# Altium project NBP9 Altera Cyclone BGA456 Rev1.00.PrjPcb
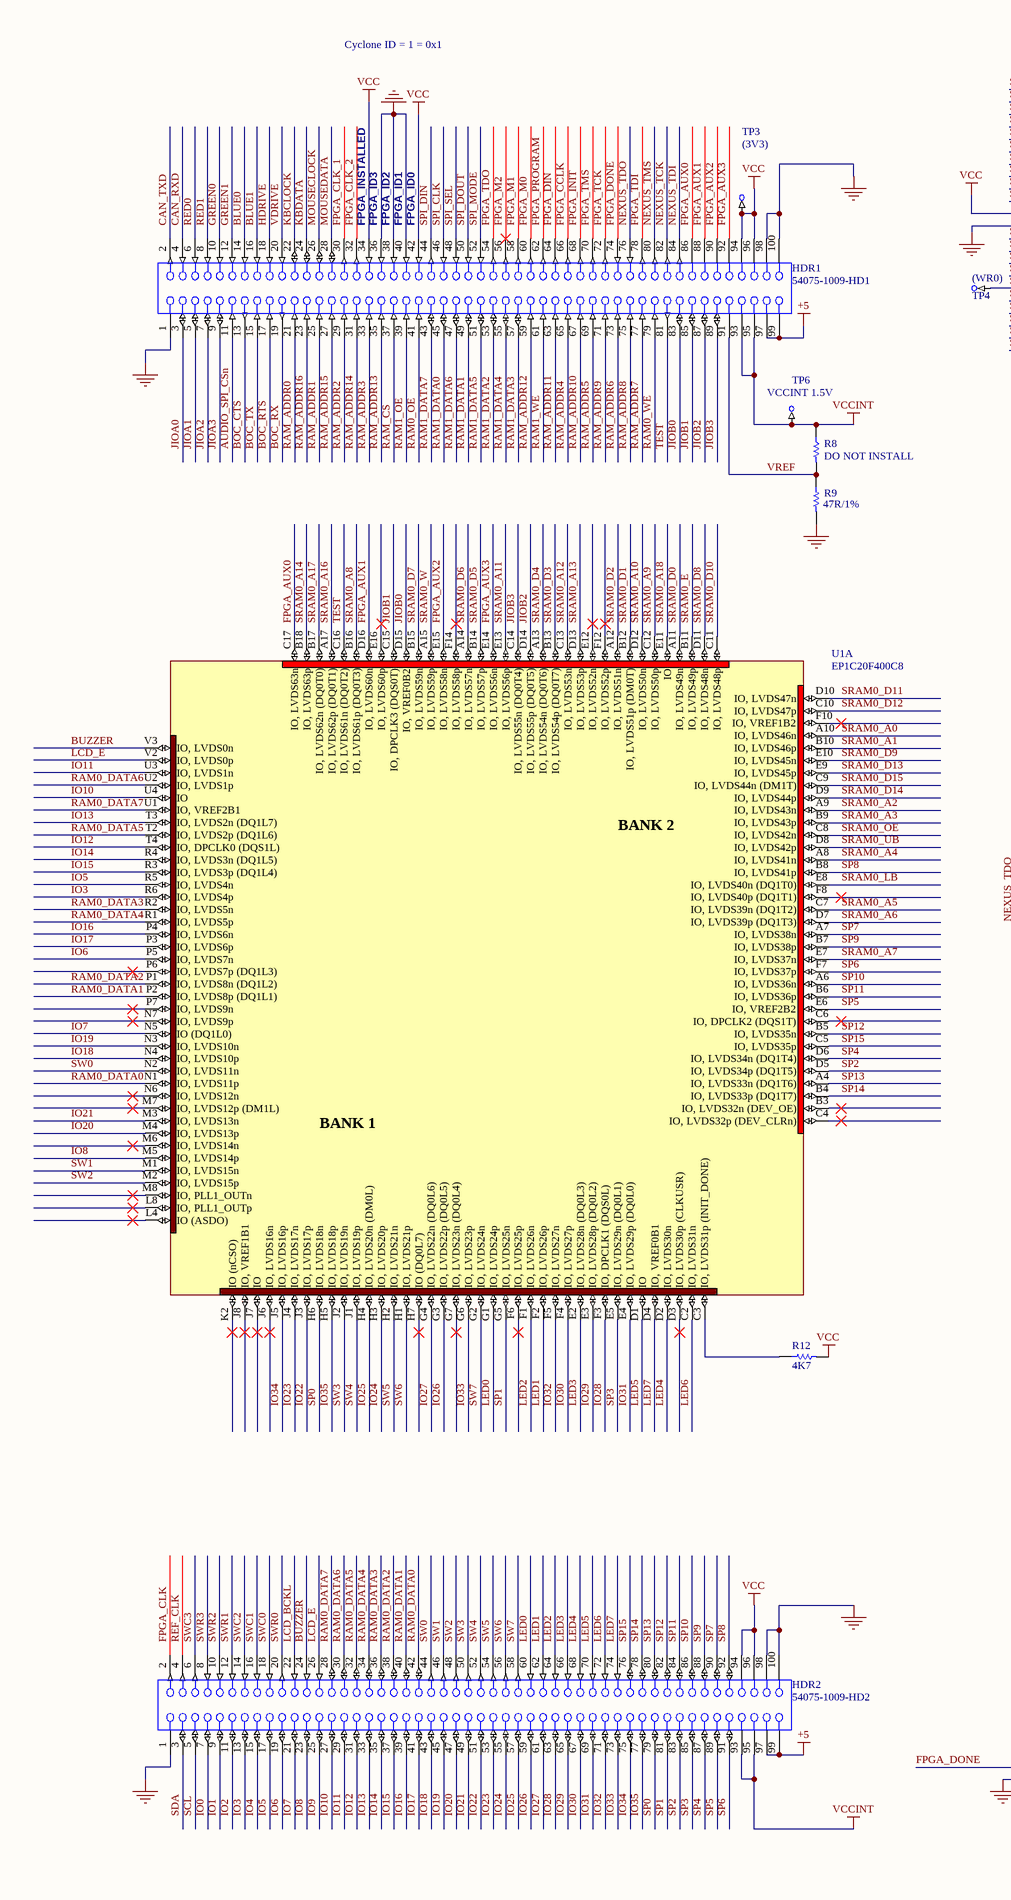
[diagram p0: NBP9 Altera Cyclone BGA456 Rev1.00.SchDoc, left]
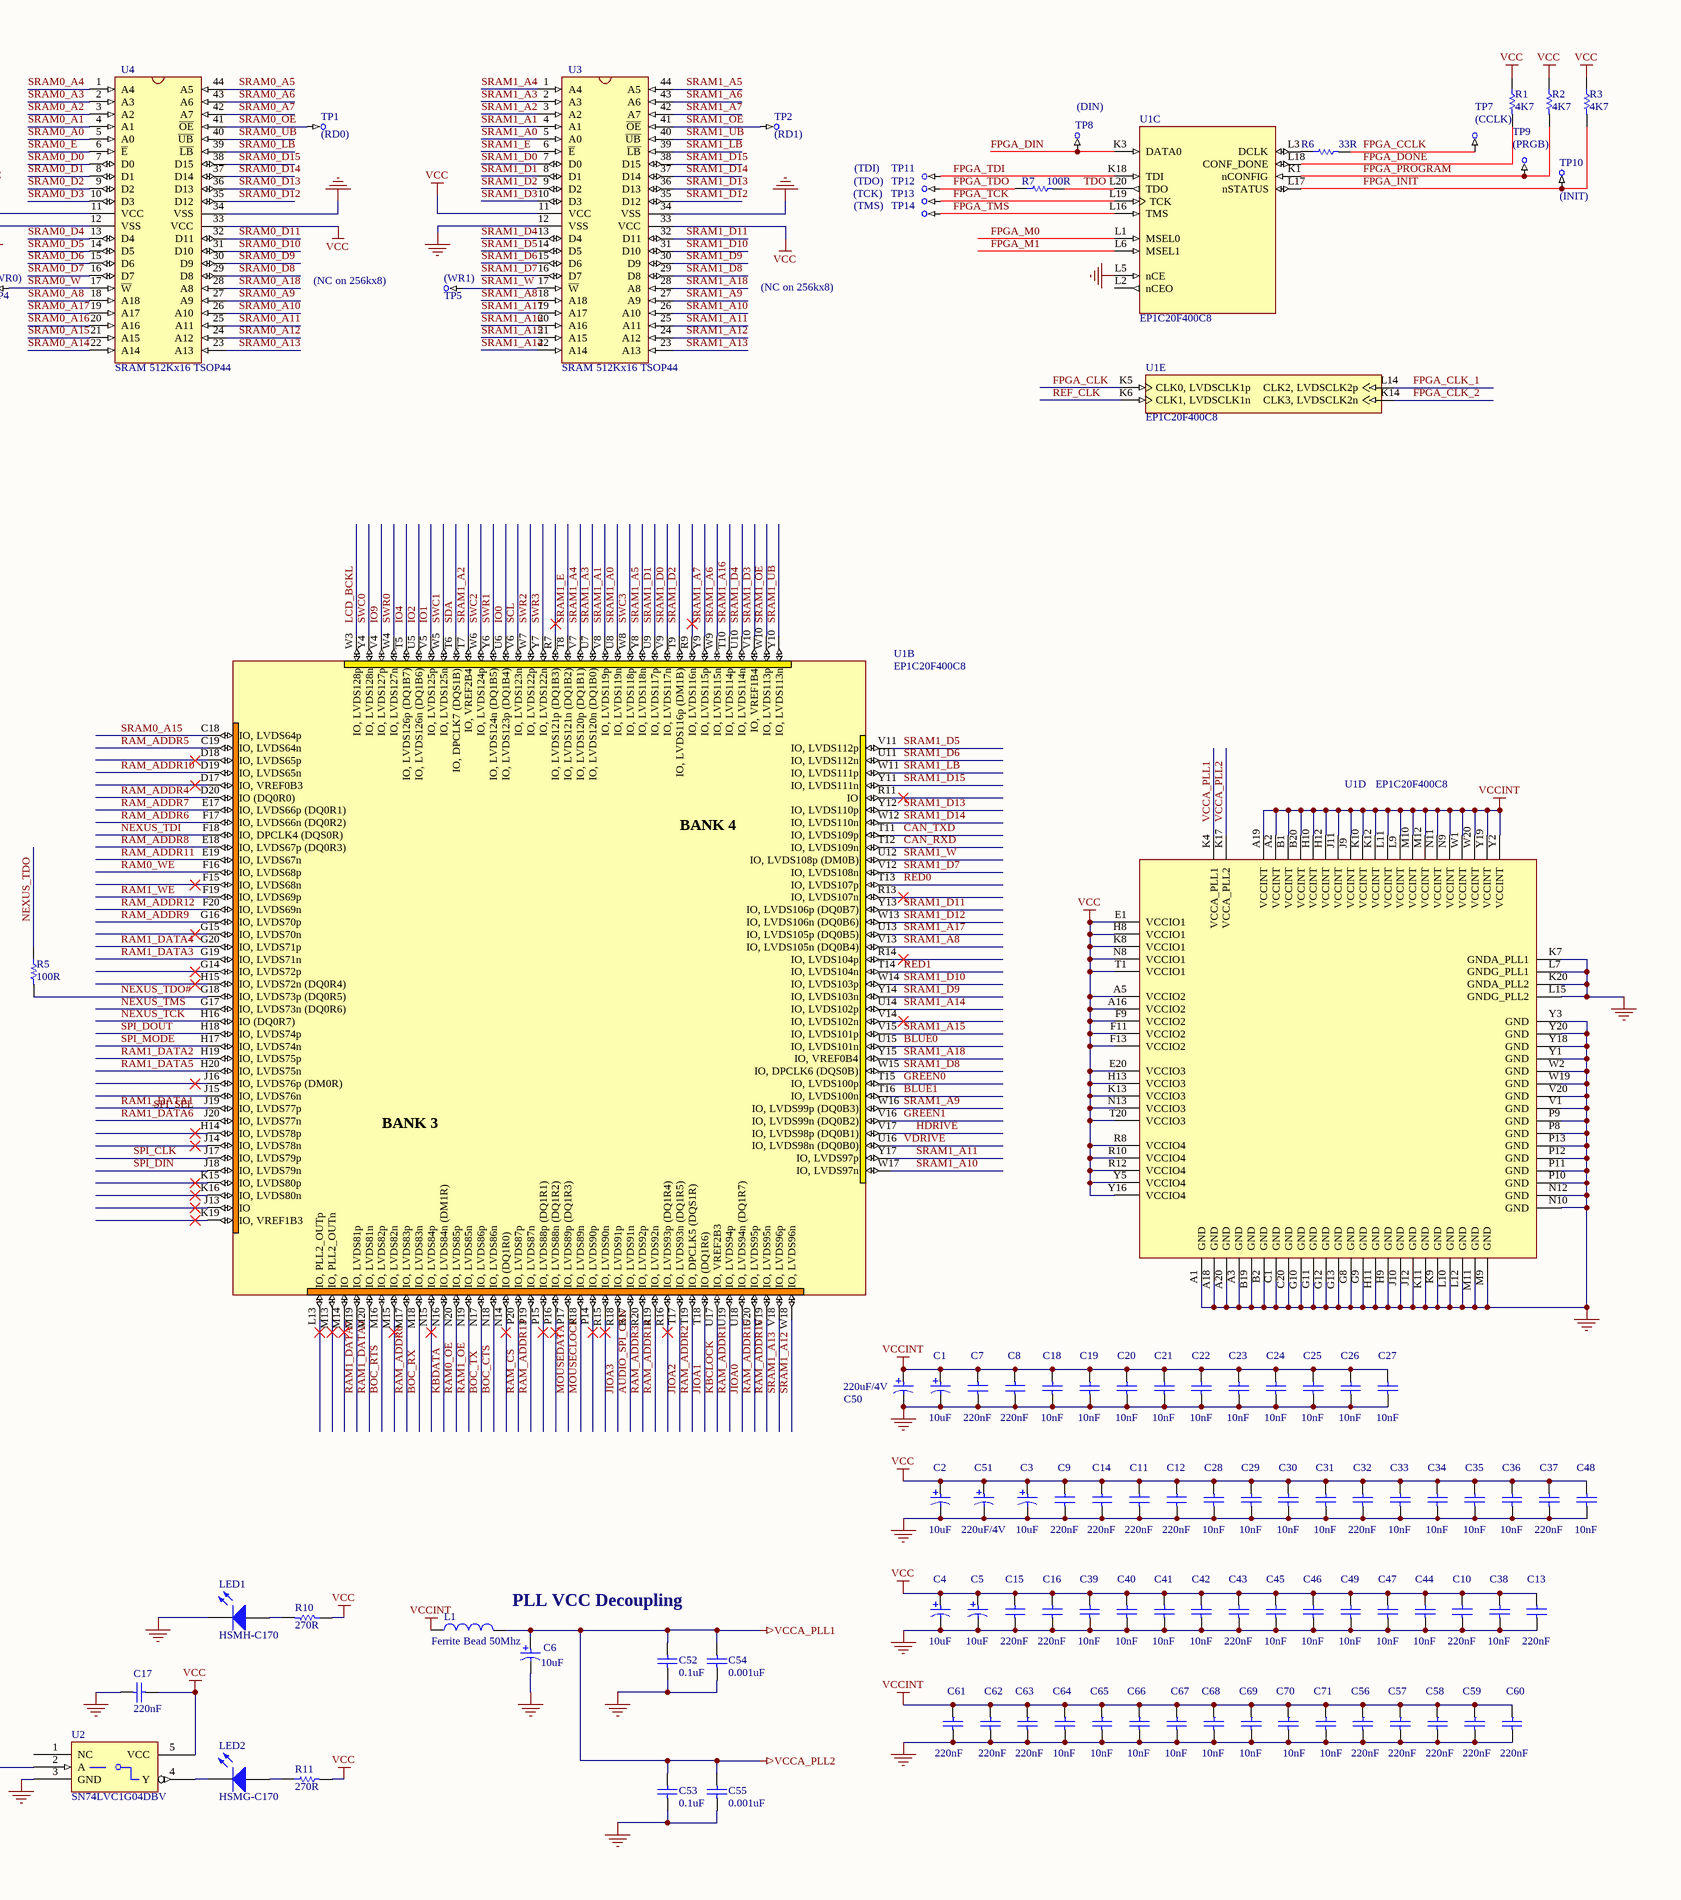
[diagram p1: NBP9 Altera Cyclone BGA456 Rev1.00.SchDoc, right]
1 sheet, 105 parts. Net scope: global (net labels, ports and power ports of the same name join across sheets).
Board file: NBP9 Altera Cyclone BGA456 Rev1.00.PcbDoc

## Sheet NBP9 Altera Cyclone BGA456 Rev1.00.SchDoc: Cyclone BGA400 Daughterboard
size A2; Author: Ch.W.; Organization: Altium Limited; Address1: L3, 12a Rodborough Rd; Address2: Frenchs Forest; Address3: NSW; Address4: Australia 2086; DocumentNumber: 1; Revision: 1.00; SheetNumber: 1; SheetTotal: 1; DocumentName: Cyclone BGA400 Daughterboard

### Parts
C1  10uF  [MCCT-B]
C2  10uF  [MCCT-B]
C3  10uF  [MCCT-B]
C4  10uF  [MCCT-B]
C5  10uF  [MCCT-B]
C6  10uF  [MCCT-B]
C7  220nF  [CC1005-0402]
C8  220nF  [CC1005-0402]
C9  220nF  [CC1608-0603]
C10  220nF  [CC1005-0402]
C11  220nF  [CC1608-0603]
C12  220nF  [CC1608-0603]
C13  220nF  [CC1005-0402]
C14  220nF  [CC1608-0603]
C15  220nF  [CC1608-0603]
C16  220nF  [CC1608-0603]
C17  220nF  [CC1608-0603]
C18  10nF  [CC1005-0402]
C19  10nF  [CC1005-0402]
C20  10nF  [CC1005-0402]
C21  10nF  [CC1005-0402]
C22  10nF  [CC1005-0402]
C23  10nF  [CC1005-0402]
C24  10nF  [CC1005-0402]
C25  10nF  [CC1005-0402]
C26  10nF  [CC1005-0402]
C27  10nF  [CC1005-0402]
C28  10nF  [CC1608-0603]
C29  10nF  [CC1608-0603]
C30  10nF  [CC1005-0402]
C31  10nF  [CC1005-0402]
C32  220nF  [CC1608-0603]
C33  10nF  [CC1608-0603]
C34  10nF  [CC1608-0603]
C35  10nF  [CC1608-0603]
C36  10nF  [CC1005-0402]
C37  220nF  [CC1608-0603]
C38  10nF  [CC1005-0402]
C39  10nF  [CC1608-0603]
C40  10nF  [CC1608-0603]
C41  10nF  [CC1608-0603]
C42  10nF  [CC1608-0603]
C43  220nF  [CC1608-0603]
C44  10nF  [CC1005-0402]
C45  10nF  [CC1608-0603]
C46  10nF  [CC1608-0603]
C47  10nF  [CC1005-0402]
C48  10nF  [CC1608-0603]
C49  10nF  [CC1005-0402]
C50  220uF/4V  [MCCT-D]
C51  220uF/4V  [MCCT-D]
C52  0.1uF  [CC1608-0603]
C53  0.1uF  [CC1608-0603]
C54  0.001uF  [CC1005-0402]
C55  0.001uF  [CC1005-0402]
C56  220nF  [CC1608-0603]
C57  220nF  [CC1608-0603]
C58  220nF  [CC1608-0603]
C59  220nF  [CC1608-0603]
C60  220nF  [CC1608-0603]
C61  220nF  [CC1608-0603]
C62  220nF  [CC1608-0603]
C63  220nF  [CC1608-0603]
C64  10nF  [CC1608-0603]
C65  10nF  [CC1608-0603]
C66  10nF  [CC1608-0603]
C67  10nF  [CC1608-0603]
C68  10nF  [CC1608-0603]
C69  10nF  [CC1608-0603]
C70  10nF  [CC1608-0603]
C71  10nF  [CC1608-0603]
HDR1  54075-1009-HD1  [54075]
HDR2  54075-1009-HD2  [54075]
L1  Ferrite Bead 50Mhz  [CC1608-0603]
LED1  HSMH-C170  [SMD _LED]
LED2  HSMG-C170  [SMD _LED]
R1  4K7  [CC2012-0805]
R2  4K7  [CC2012-0805]
R3  4K7  [CC2012-0805]
R5  100R  [CR2012-0805]
R6  33R  [CC2012-0805]
R7  100R  [CC2012-0805]
R8  DO NOT INSTALL  [CR2012-0805]
R9  47R/1%  [CR2012-0805]
R10  270R  [CR2012-0805]
R11  270R  [CR2012-0805]
R12  4K7  [CC2012-0805]
TP1  (RD0)  [TestPin]  (no BOM)
TP2  (RD1)  [TestPin]  (no BOM)
TP3  (3V3)  [TestPin]  (no BOM)
TP4  (WR0)  [TestPin]  (no BOM)
TP5  (WR1)  [TestPin]  (no BOM)
TP6  VCCINT 1.5V  [TestPin]  (no BOM)
TP7  (CCLK)  [TestPin]  (no BOM)
TP8  (DIN)  [TestPin]  (no BOM)
TP9  (PRGB)  [TestPin]  (no BOM)
TP10  (INIT)  [TestPin]  (no BOM)
TP11  (TDI)  [TestPin]  (no BOM)
TP12  (TDO)  [TestPin]  (no BOM)
TP13  (TCK)  [TestPin]  (no BOM)
TP14  (TMS)  [TestPin]  (no BOM)
U1  EP1C20F400C8  [FBGA400]  (parts A,B,C,D,E of 5)
U2  SN74LVC1G04DBV  [SO-G5/P.95]
U3  SRAM 512Kx16 TSOP44  [SO-G44/P.8]
U4  SRAM 512Kx16 TSOP44  [SO-G44/P.8]

### Nets
+5: HDR1.97 HDR1.99 HDR2.97 HDR2.99
GND: C1.2 C2.2 C3.2 C4.2 C5.2 C6.2 C7.2 C8.2 C9.2 C10.2 C11.2 C12.2 C13.2 C14.2 C15.2 C16.2 C17.1 C18.2 C19.2 C20.2 C21.2 C22.2 C23.2 C24.2 C25.2 C26.2 C27.2 C28.2 C29.2 C30.2 C31.2 C32.2 C33.2 C34.2 C35.2 C36.2 C37.2 C38.2 C39.2 C40.2 C41.2 C42.2 C43.2 C44.2 C45.2 C46.2 C47.2 C48.2 C49.2 C50.2 C51.2 C52.2 C53.2 C54.2 C55.2 C56.2 C57.2 C58.2 C59.2 C60.2 C61.2 C62.2 C63.2 C64.2 C65.2 C66.2 C67.2 C68.2 C69.2 C70.2 C71.2 HDR1.1 HDR1.36 HDR1.38 HDR1.40 HDR1.98 HDR1.100 HDR2.1 HDR2.98 HDR2.100 LED1.2(K) R9.2 U1.A1(GND) U1.A3(GND) U1.A18(GND) U1.A20(GND) U1.B2(GND) U1.B19(GND) U1.C1(GND) U1.C20(GND) U1.G8(GND) U1.G9(GND) U1.G10(GND) U1.G11(GND) U1.G12(GND) U1.G13(GND) U1.H9(GND) U1.H11(GND) U1.J10(GND) U1.J12(GND) U1.K7(GNDA_PLL1) U1.K9(GND) U1.K11(GND) U1.K20(GNDA_PLL2) U1.L5(nCE) U1.L7(GNDG_PLL1) U1.L10(GND) U1.L12(GND) U1.L15(GNDG_PLL2) U1.M9(GND) U1.M11(GND) U1.N10(GND) U1.N12(GND) U1.P8(GND) U1.P9(GND) U1.P10(GND) U1.P11(GND) U1.P12(GND) U1.P13(GND) U1.V1(GND) U1.V20(GND) U1.W2(GND) U1.W19(GND) U1.Y1(GND) U1.Y3(GND) U1.Y18(GND) U1.Y20(GND) U2.3(GND) U3.12(VSS) U3.34(VSS) U4.12(VSS) U4.34(VSS)
VCC: C2.1 C3.1 C4.1 C5.1 C9.1 C10.1 C11.1 C12.1 C13.1 C14.1 C15.1 C16.1 C17.2 C28.1 C29.1 C30.1 C31.1 C32.1 C33.1 C34.1 C35.1 C36.1 C37.1 C38.1 C39.1 C40.1 C41.1 C42.1 C43.1 C44.1 C45.1 C46.1 C47.1 C48.1 C49.1 C51.1 HDR1.34 HDR1.42 HDR1.94 HDR1.96 HDR2.94 HDR2.96 R1.1 R2.1 R3.1 R10.1 R11.2 R12.2 TP3.1 U1.A5(VCCIO2) U1.A16(VCCIO2) U1.E1(VCCIO1) U1.E20(VCCIO3) U1.F9(VCCIO2) U1.F11(VCCIO2) U1.F13(VCCIO2) U1.H8(VCCIO1) U1.H13(VCCIO3) U1.K8(VCCIO1) U1.K13(VCCIO3) U1.N8(VCCIO1) U1.N13(VCCIO3) U1.R8(VCCIO4) U1.R10(VCCIO4) U1.R12(VCCIO4) U1.T1(VCCIO1) U1.T20(VCCIO3) U1.Y5(VCCIO4) U1.Y16(VCCIO4) U2.5(VCC) U3.11(VCC) U3.33(VCC) U4.11(VCC) U4.33(VCC)
VCCA_PLL1: C6.1 C52.1 C53.1 C54.1 C55.1 L1.2 U1.K4(VCCA_PLL1) U1.K17(VCCA_PLL2)  [also labelled VCCA_PLL2]
VCCINT: C1.1 C7.1 C8.1 C18.1 C19.1 C20.1 C21.1 C22.1 C23.1 C24.1 C25.1 C26.1 C27.1 C50.1 C56.1 C57.1 C58.1 C59.1 C60.1 C61.1 C62.1 C63.1 C64.1 C65.1 C66.1 C67.1 C68.1 C69.1 C70.1 C71.1 HDR1.93 HDR1.95 HDR2.93 HDR2.95 L1.1 R8.1 TP6.1 U1.A2(VCCINT) U1.A19(VCCINT) U1.B1(VCCINT) U1.B20(VCCINT) U1.H10(VCCINT) U1.H12(VCCINT) U1.J9(VCCINT) U1.J11(VCCINT) U1.K10(VCCINT) U1.K12(VCCINT) U1.L9(VCCINT) U1.L11(VCCINT) U1.M10(VCCINT) U1.M12(VCCINT) U1.N9(VCCINT) U1.N11(VCCINT) U1.W1(VCCINT) U1.W20(VCCINT) U1.Y2(VCCINT) U1.Y19(VCCINT)
AUDIO_SPI_CSn: HDR1.11 U1.R17(IO,_LVDS91n)
BLUE0: HDR1.14 U1.U15(IO,_LVDS101n)
BLUE1: HDR1.16 U1.T16(IO,_LVDS100n)
BOC_CTS: HDR1.13 U1.N18(IO,_LVDS86n)
BOC_RTS: HDR1.17 U1.M16(IO,_LVDS82p)
BOC_RX: HDR1.19 U1.M18(IO,_LVDS83n)
BOC_TX: HDR1.15 U1.N17(IO,_LVDS86p)
BUZZER: HDR2.24 U1.V3(IO,_LVDS0n)
CAN_RXD: HDR1.4 U1.T12(IO,_LVDS109n)
CAN_TXD: HDR1.2 U1.T11(IO,_LVDS109p)
FPGA_AUX0: HDR1.86 U1.C17(IO,_LVDS63n)
FPGA_AUX1: HDR1.88 U1.D16(IO,_LVDS60n)
FPGA_AUX2: HDR1.90 U1.E15(IO,_LVDS58n)
FPGA_AUX3: HDR1.92 U1.E14(IO,_LVDS56n)
FPGA_CCLK: HDR1.66 R6.2 TP7.1
FPGA_CLK: HDR2.2 U1.K5(CLK0,_LVDSCLK1p)
FPGA_CLK_1: HDR1.30 U1.L14(CLK2,_LVDSCLK2p)
FPGA_CLK_2: HDR1.32 U1.K14(CLK3,_LVDSCLK2n)
FPGA_DIN: HDR1.64 TP8.1 U1.K3(DATA0)
FPGA_DONE: HDR1.74 R1.2 U1.L18(CONF_DONE) U2.2(A)
FPGA_INIT: HDR1.68 R3.2 TP10.1 U1.L17(nSTATUS)
FPGA_M0: HDR1.60 U1.L1(MSEL0)
FPGA_M1: HDR1.58 U1.L6(MSEL1)
FPGA_M2: HDR1.56
FPGA_PROGRAM: HDR1.62 R2.2 TP9.1 U1.K1(nCONFIG)
FPGA_TCK: HDR1.72 TP13.1 U1.L19(TCK)
FPGA_TDI: HDR1.78 TP11.1 U1.K18(TDI)
FPGA_TDO: HDR1.54 R7.1 TP12.1
FPGA_TMS: HDR1.70 TP14.1 U1.L16(TMS)
GREEN0: HDR1.10 U1.T15(IO,_LVDS100p)
GREEN1: HDR1.12 U1.V16(IO,_LVDS99n_(DQ0B2))
HDRIVE: HDR1.18 U1.V17(IO,_LVDS98p_(DQ0B1))
IO0: HDR2.7 U1.U6(IO,_LVDS123p_(DQ1B4))
IO1: HDR2.9 U1.V5(IO,_LVDS125p)
IO2: HDR2.11 U1.U5(IO,_LVDS126n_(DQ1B6))
IO3: HDR2.13 U1.R6(IO,_LVDS4p)
IO4: HDR2.15 U1.T5(IO,_LVDS126p_(DQ1B7))
IO5: HDR2.17 U1.R5(IO,_LVDS4n)
IO6: HDR2.19 U1.P5(IO,_LVDS7n)
IO7: HDR2.21 U1.N5(IO_(DQ1L0))
IO8: HDR2.23 U1.M5(IO,_LVDS14p)
IO9: HDR2.25 U1.V4(IO,_LVDS127p)
IO10: HDR2.27 U1.U4(IO)
IO11: HDR2.29 U1.U3(IO,_LVDS1n)
IO12: HDR2.31 U1.T4(IO,_DPCLK0_(DQS1L))
IO13: HDR2.33 U1.T3(IO,_LVDS2n_(DQ1L7))
IO14: HDR2.35 U1.R4(IO,_LVDS3n_(DQ1L5))
IO15: HDR2.37 U1.R3(IO,_LVDS3p_(DQ1L4))
IO16: HDR2.39 U1.P4(IO,_LVDS6n)
IO17: HDR2.41 U1.P3(IO,_LVDS6p)
IO18: HDR2.43 U1.N4(IO,_LVDS10p)
IO19: HDR2.45 U1.N3(IO,_LVDS10n)
IO20: HDR2.47 U1.M4(IO,_LVDS13p)
IO21: HDR2.49 U1.M3(IO,_LVDS13n)
IO22: HDR2.51 U1.J3(IO,_LVDS17p)
IO23: HDR2.53 U1.J4(IO,_LVDS17n)
IO24: HDR2.55 U1.H3(IO,_LVDS20p)
IO25: HDR2.57 U1.H4(IO,_LVDS20n_(DM0L))
IO26: HDR2.59 U1.G3(IO,_LVDS22p_(DQ0L5))
IO27: HDR2.61 U1.G4(IO,_LVDS22n_(DQ0L6))
IO28: HDR2.63 U1.F3(IO,_DPCLK1_(DQS0L))
IO29: HDR2.65 U1.E3(IO,_LVDS28p_(DQ0L2))
IO30: HDR2.67 U1.F4(IO,_LVDS27p)
IO31: HDR2.69 U1.E4(IO,_LVDS29p_(DQ0L0))
IO32: HDR2.71 U1.F5(IO,_LVDS27n)
IO33: HDR2.73 U1.G6(IO,_LVDS23p)
IO34: HDR2.75 U1.J5(IO,_LVDS16p)
IO35: HDR2.77 U1.H5(IO,_LVDS18p)
JIOA0: HDR1.3 U1.U18(IO,_LVDS94n_(DQ1R7))
JIOA1: HDR1.5 U1.T18(IO_(DQ1R6))
JIOA2: HDR1.7 U1.T17(IO,_LVDS93n_(DQ1R5))
JIOA3: HDR1.9 U1.R18(IO,_LVDS91p)
JIOB0: HDR1.83 U1.D15(IO,_VREF0B2)
JIOB1: HDR1.85 U1.C15(IO,_DPCLK3_(DQS0T))
JIOB2: HDR1.87 U1.D14(IO,_LVDS55p_(DQ0T5))
JIOB3: HDR1.89 U1.C14(IO,_LVDS55n_(DQ0T4))
KBCLOCK: HDR1.22 U1.U17(IO,_VREF2B3)
KBDATA: HDR1.24 U1.N16(IO,_LVDS84n_(DM1R))
LCD_BCKL: HDR2.22 U1.W3(IO,_LVDS128p)
LCD_E: HDR2.26 U1.V2(IO,_LVDS0p)
LED0: HDR2.60 U1.G1(IO,_LVDS24p)
LED1: HDR2.62 U1.F2(IO,_LVDS26p)
LED2: HDR2.64 U1.F1(IO,_LVDS26n)
LED3: HDR2.66 U1.E2(IO,_LVDS28n_(DQ0L3))
LED4: HDR2.68 U1.D2(IO,_LVDS30n)
LED5: HDR2.70 U1.D1(IO)
LED6: HDR2.72 U1.C2(IO,_LVDS31n)
LED7: HDR2.74 U1.D4(IO,_VREF0B1)
MOUSECLOCK: HDR1.26 U1.P18(IO,_LVDS89n)
MOUSEDATA: HDR1.28 U1.P17(IO,_LVDS89p_(DQ1R3))
NEXUS_TCK: HDR1.82 U1.H16(IO_(DQ0R7))
NEXUS_TDI: HDR1.84 U1.F18(IO,_DPCLK4_(DQS0R))
NEXUS_TDO: HDR1.76 R5.1
NEXUS_TDO#: R5.2 U1.G18(IO,_LVDS73p_(DQ0R5))
NEXUS_TMS: HDR1.80 U1.G17(IO,_LVDS73n_(DQ0R6))
RAM0_DATA0: HDR2.42 U1.N1(IO,_LVDS11p)
RAM0_DATA1: HDR2.40 U1.P2(IO,_LVDS8p_(DQ1L1))
RAM0_DATA2: HDR2.38 U1.P1(IO,_LVDS8n_(DQ1L2))
RAM0_DATA3: HDR2.36 U1.R2(IO,_LVDS5n)
RAM0_DATA4: HDR2.34 U1.R1(IO,_LVDS5p)
RAM0_DATA5: HDR2.32 U1.T2(IO,_LVDS2p_(DQ1L6))
RAM0_DATA6: HDR2.30 U1.U2(IO,_LVDS1p)
RAM0_DATA7: HDR2.28 U1.U1(IO,_VREF2B1)
RAM0_OE: HDR1.41 U1.N20(IO,_LVDS85p)
RAM0_WE: HDR1.79 U1.F16(IO,_LVDS68p)
RAM1_DATA0: HDR1.45 U1.M20(IO,_LVDS81n)
RAM1_DATA1: HDR1.49 U1.J19(IO,_LVDS77p)
RAM1_DATA2: HDR1.53 U1.H19(IO,_LVDS75p)
RAM1_DATA3: HDR1.57 U1.G19(IO,_LVDS71n)
RAM1_DATA4: HDR1.55 U1.G20(IO,_LVDS71p)
RAM1_DATA5: HDR1.51 U1.H20(IO,_LVDS75n)
RAM1_DATA6: HDR1.47 U1.J20(IO,_LVDS77n)
RAM1_DATA7: HDR1.43 U1.M19(IO,_LVDS81p)
RAM1_OE: HDR1.39 U1.N19(IO,_LVDS85n)
RAM1_WE: HDR1.61 U1.F19(IO,_LVDS69p)
RAM_ADDR0: HDR1.21 U1.M17(IO,_LVDS83p)
RAM_ADDR1: HDR1.25 U1.U19(IO,_LVDS94p)
RAM_ADDR2: HDR1.29 U1.T19(IO,_DPCLK5_(DQS1R))
RAM_ADDR3: HDR1.33 U1.R20(IO,_LVDS92p)
RAM_ADDR4: HDR1.65 U1.D20(IO_(DQ0R0))
RAM_ADDR5: HDR1.69 U1.C19(IO,_LVDS64n)
RAM_ADDR6: HDR1.73 U1.F17(IO,_LVDS66n_(DQ0R2))
RAM_ADDR7: HDR1.77 U1.E17(IO,_LVDS66p_(DQ0R1))
RAM_ADDR8: HDR1.75 U1.E18(IO,_LVDS67p_(DQ0R3))
RAM_ADDR9: HDR1.71 U1.G16(IO,_LVDS70p)
RAM_ADDR10: HDR1.67 U1.D19(IO,_LVDS65n)
RAM_ADDR11: HDR1.63 U1.E19(IO,_LVDS67n)
RAM_ADDR12: HDR1.59 U1.F20(IO,_LVDS69n)
RAM_ADDR13: HDR1.35 U1.P19(IO,_LVDS87n)
RAM_ADDR14: HDR1.31 U1.R19(IO,_LVDS92n)
RAM_ADDR15: HDR1.27 U1.U20(IO,_LVDS95p)
RAM_ADDR16: HDR1.23 U1.V19(IO,_LVDS95n)
RAM_CS: HDR1.37 U1.P20(IO,_LVDS87p)
RED0: HDR1.6 U1.T13(IO,_LVDS107p)
RED1: HDR1.8 U1.T14(IO,_LVDS104n)
REF_CLK: HDR2.4 U1.K6(CLK1,_LVDSCLK1n)
SCL: HDR2.5 U1.V6(IO,_LVDS123n)
SDA: HDR2.3 U1.T6(IO,_DPCLK7_(DQS1B))
SP0: HDR2.79 U1.H6(IO,_LVDS18n)
SP1: HDR2.81 U1.G5(IO,_LVDS25n)
SP2: HDR2.83 U1.D5(IO,_LVDS34p_(DQ1T5))
SP3: HDR2.85 U1.E5(IO,_LVDS29n_(DQ0L1))
SP4: HDR2.87 U1.D6(IO,_LVDS34n_(DQ1T4))
SP5: HDR2.89 U1.E6(IO,_VREF2B2)
SP6: HDR2.91 U1.F7(IO,_LVDS37p)
SP7: HDR2.90 U1.A7(IO,_LVDS38n)
SP8: HDR2.92 U1.B8(IO,_LVDS41p)
SP9: HDR2.88 U1.B7(IO,_LVDS38p)
SP10: HDR2.86 U1.A6(IO,_LVDS36n)
SP11: HDR2.84 U1.B6(IO,_LVDS36p)
SP12: HDR2.82 U1.B5(IO,_LVDS35n)
SP13: HDR2.80 U1.A4(IO,_LVDS33n_(DQ1T6))
SP14: HDR2.78 U1.B4(IO,_LVDS33p_(DQ1T7))
SP15: HDR2.76 U1.C5(IO,_LVDS35p)
SPI_CLK: HDR1.46 U1.J17(IO,_LVDS79p)
SPI_DIN: HDR1.44 U1.J18(IO,_LVDS79n)
SPI_DOUT: HDR1.50 U1.H18(IO,_LVDS74p)
SPI_MODE: HDR1.52 U1.H17(IO,_LVDS74n)
SPI_SEL: HDR1.48 U1.J15(IO,_LVDS76n)
SRAM0_A0: U1.A10(IO,_LVDS46n) U3.5(A0)
SRAM0_A1: U1.B10(IO,_LVDS46p) U3.4(A1)
SRAM0_A2: U1.A9(IO,_LVDS43n) U3.3(A2)
SRAM0_A3: U1.B9(IO,_LVDS43p) U3.2(A3)
SRAM0_A4: U1.A8(IO,_LVDS41n) U3.1(A4)
SRAM0_A5: U1.C7(IO,_LVDS39n_(DQ1T2)) U3.44(A5)
SRAM0_A6: U1.D7(IO,_LVDS39p_(DQ1T3)) U3.43(A6)
SRAM0_A7: U1.E7(IO,_LVDS37n) U3.42(A7)
SRAM0_A8: U1.B16(IO,_LVDS61p_(DQ0T3)) U3.18(A18)
SRAM0_A9: U1.C12(IO,_LVDS50p) U3.27(A9)
SRAM0_A10: U1.D12(IO,_LVDS50n) U3.26(A10)
SRAM0_A11: U1.E13(IO,_LVDS56p) U3.25(A11)
SRAM0_A12: U1.C13(IO,_LVDS53n) U3.24(A12)
SRAM0_A13: U1.D13(IO,_LVDS53p) U3.23(A13)
SRAM0_A14: U1.B18(IO,_LVDS63p) U3.22(A14)
SRAM0_A15: U1.C18(IO,_LVDS64p) U3.21(A15)
SRAM0_A16: U1.A17(IO,_LVDS62p_(DQ0T1)) U3.20(A16)
SRAM0_A17: U1.B17(IO,_LVDS62n_(DQ0T0)) U3.19(A17)
SRAM0_A18: U1.E11(IO) U3.28(A8)
SRAM0_D0: U1.A11(IO,_LVDS49n) U3.7(D0)
SRAM0_D1: U1.B12(IO,_LVDS51p_(DM0T)) U3.8(D1)
SRAM0_D2: U1.A12(IO,_LVDS51n) U3.9(D2)
SRAM0_D3: U1.B13(IO,_LVDS54p_(DQ0T7)) U3.10(D3)
SRAM0_D4: U1.A13(IO,_LVDS54n_(DQ0T6)) U3.13(D4)
SRAM0_D5: U1.B14(IO,_LVDS57p) U3.14(D5)
SRAM0_D6: U1.A14(IO,_LVDS57n) U3.15(D6)
SRAM0_D7: U1.B15(IO,_LVDS59n) U3.16(D7)
SRAM0_D8: U1.D11(IO,_LVDS48n) U3.29(D8)
SRAM0_D9: U1.E10(IO,_LVDS45n) U3.30(D9)
SRAM0_D10: U1.C11(IO,_LVDS48p) U3.31(D10)
SRAM0_D11: U1.D10(IO,_LVDS47n) U3.32(D11)
SRAM0_D12: U1.C10(IO,_LVDS47p) U3.35(D12)
SRAM0_D13: U1.E9(IO,_LVDS45p) U3.36(D13)
SRAM0_D14: U1.D9(IO,_LVDS44p) U3.37(D14)
SRAM0_D15: U1.C9(IO,_LVDS44n_(DM1T)) U3.38(D15)
SRAM0_E: U1.B11(IO,_LVDS49p) U3.6(~{E})
SRAM0_LB: U1.E8(IO,_LVDS40n_(DQ1T0)) U3.39(~{LB})
SRAM0_OE: TP1.1 U1.C8(IO,_LVDS42n) U3.41(~{OE})
SRAM0_UB: U1.D8(IO,_LVDS42p) U3.40(~{UB})
SRAM0_W: TP4.1 U1.A15(IO,_LVDS59p) U3.17(~{W})
SRAM1_A0: U1.U8(IO,_LVDS119n) U4.5(A0)
SRAM1_A1: U1.V8(IO,_LVDS119p) U4.4(A1)
SRAM1_A2: U1.T7(IO,_VREF2B4) U4.3(A2)
SRAM1_A3: U1.U7(IO,_LVDS120n_(DQ1B0)) U4.2(A3)
SRAM1_A4: U1.V7(IO,_LVDS120p_(DQ1B1)) U4.1(A4)
SRAM1_A5: U1.Y8(IO,_LVDS118n) U4.44(A5)
SRAM1_A6: U1.W9(IO,_LVDS115n) U4.43(A6)
SRAM1_A7: U1.Y9(IO,_LVDS115p) U4.42(A7)
SRAM1_A8: U1.V13(IO,_LVDS105n_(DQ0B4)) U4.18(A18)
SRAM1_A9: U1.W16(IO,_LVDS99p_(DQ0B3)) U4.27(A9)
SRAM1_A10: U1.W17(IO,_LVDS97n) U4.26(A10)
SRAM1_A11: U1.Y17(IO,_LVDS97p) U4.25(A11)
SRAM1_A12: U1.W18(IO,_LVDS96n) U4.24(A12)
SRAM1_A13: U1.V18(IO,_LVDS96p) U4.23(A13)
SRAM1_A14: U1.U14(IO,_LVDS102p) U4.22(A14)
SRAM1_A15: U1.V15(IO,_LVDS101p) U4.21(A15)
SRAM1_A16: U1.T10(IO,_LVDS114p) U4.20(A16)
SRAM1_A17: U1.U13(IO,_LVDS105p_(DQ0B5)) U4.19(A17)
SRAM1_A18: U1.Y15(IO,_VREF0B4) U4.28(A8)
SRAM1_D0: U1.V9(IO,_LVDS117n) U4.7(D0)
SRAM1_D1: U1.U9(IO,_LVDS117p) U4.8(D1)
SRAM1_D2: U1.T9(IO,_LVDS116p_(DM1B)) U4.9(D2)
SRAM1_D3: U1.V10(IO,_VREF1B4) U4.10(D3)
SRAM1_D4: U1.U10(IO,_LVDS114n) U4.13(D4)
SRAM1_D5: U1.V11(IO,_LVDS112p) U4.14(D5)
SRAM1_D6: U1.U11(IO,_LVDS112n) U4.15(D6)
SRAM1_D7: U1.V12(IO,_LVDS108n) U4.16(D7)
SRAM1_D8: U1.W15(IO,_DPCLK6_(DQS0B)) U4.29(D8)
SRAM1_D9: U1.Y14(IO,_LVDS103n) U4.30(D9)
SRAM1_D10: U1.W14(IO,_LVDS103p) U4.31(D10)
SRAM1_D11: U1.Y13(IO,_LVDS106p_(DQ0B7)) U4.32(D11)
SRAM1_D12: U1.W13(IO,_LVDS106n_(DQ0B6)) U4.35(D12)
SRAM1_D13: U1.Y12(IO,_LVDS110p) U4.36(D13)
SRAM1_D14: U1.W12(IO,_LVDS110n) U4.37(D14)
SRAM1_D15: U1.Y11(IO,_LVDS111n) U4.38(D15)
SRAM1_E: U1.T8(IO,_LVDS121n_(DQ1B2)) U4.6(~{E})
SRAM1_LB: U1.W11(IO,_LVDS111p) U4.39(~{LB})
SRAM1_OE: TP2.1 U1.W10(IO,_LVDS113p) U4.41(~{OE})
SRAM1_UB: U1.Y10(IO,_LVDS113n) U4.40(~{UB})
SRAM1_W: TP5.1 U1.U12(IO,_LVDS108p_(DM0B)) U4.17(~{W})
SW0: HDR2.44 U1.N2(IO,_LVDS11n)
SW1: HDR2.46 U1.M1(IO,_LVDS15n)
SW2: HDR2.48 U1.M2(IO,_LVDS15p)
SW3: HDR2.50 U1.J2(IO,_LVDS19n)
SW4: HDR2.52 U1.J1(IO,_LVDS19p)
SW5: HDR2.54 U1.H2(IO,_LVDS21n)
SW6: HDR2.56 U1.H1(IO,_LVDS21p)
SW7: HDR2.58 U1.G2(IO,_LVDS24n)
SWC0: HDR2.18 U1.Y4(IO,_LVDS128n)
SWC1: HDR2.16 U1.W5(IO,_LVDS125n)
SWC2: HDR2.14 U1.W6(IO,_LVDS124p)
SWC3: HDR2.6 U1.W8(IO,_LVDS118p)
SWR0: HDR2.20 U1.W4(IO,_LVDS127n)
SWR1: HDR2.12 U1.Y6(IO,_LVDS124n_(DQ1B5))
SWR2: HDR2.10 U1.W7(IO,_LVDS122p)
SWR3: HDR2.8 U1.Y7(IO,_LVDS122n)
TDO: R7.2 U1.L20(TDO)
TEST: HDR1.81 U1.C16(IO,_LVDS61n_(DQ0T2))
VDRIVE: HDR1.20 U1.U16(IO,_LVDS98n_(DQ0B0))
VREF: HDR1.91 R8.2 R9.1
NetLED1_1: LED1.1(A) R10.2
NetLED2_1: LED2.1(A) R11.1
NetLED2_2: LED2.2(K) U2.4(Y)
NetR6_1: R6.1 U1.L3(DCLK)
NetR12_1: R12.1 U1.C3(IO,_LVDS31p_(INIT_DONE))

Not connected (* = marked no-connect by the designer): U1 B3(IO,_LVDS32n_(DEV_OE))* C4(IO,_LVDS32p_(DEV_CLRn))* C6(IO,_DPCLK2_(DQS1T))* D3(IO,_LVDS30p_(CLKUSR))* D17(IO,_VREF0B3)* D18(IO,_LVDS65p)* E12(IO,_LVDS52n)* E16(IO,_LVDS60p)* F6(IO,_LVDS25p)* F8(IO,_LVDS40p_(DQ1T1))* F10(IO,_VREF1B2)* F12(IO,_LVDS52p)* F14(IO,_LVDS58p)* F15(IO,_LVDS68n)* G7(IO,_LVDS23n_(DQ0L4))* G14(IO,_LVDS72p)* G15(IO,_LVDS70n)* H7(IO_(DQ0L7))* H14(IO,_LVDS78p)* H15(IO,_LVDS72n_(DQ0R4))* J6(IO,_LVDS16n)* J7(IO)* J8(IO,_VREF1B1)* J13(IO)* J14(IO,_LVDS78n)* J16(IO,_LVDS76p_(DM0R))* K2(IO_(nCSO))* K15(IO,_LVDS80p)* K16(IO,_LVDS80n)* K19(IO,_VREF1B3)* L2(nCEO) L4(IO_(ASDO))* L8(IO,_PLL1_OUTp)* L13(IO,_PLL2_OUTp)* M6(IO,_LVDS14n)* M7(IO,_LVDS12p_(DM1L))* M8(IO,_PLL1_OUTn)* M13(IO,_PLL2_OUTn)* M14(IO)* M15(IO,_LVDS82n)* N6(IO,_LVDS12n)* N7(IO,_LVDS9p)* N14(IO_(DQ1R0))* N15(IO,_LVDS84p)* P6(IO,_LVDS7p_(DQ1L3))* P7(IO,_LVDS9n)* P14(IO,_LVDS90p)* P15(IO,_LVDS88p_(DQ1R1))* P16(IO,_LVDS88n_(DQ1R2))* R7(IO,_LVDS121p_(DQ1B3))* R9(IO,_LVDS116n)* R11(IO)* R13(IO,_LVDS107n)* R14(IO,_LVDS104p)* R15(IO,_LVDS90n)* R16(IO,_LVDS93p_(DQ1R4))* V14(IO,_LVDS102n)*; U2 1(NC)

### Notes on the sheet
- Cyclone ID = 1 = 0x1
- (near HDR1) FPGA_INSTALLED
- (near HDR1) FPGA_ID3
- (near HDR1) FPGA_ID2
- (near HDR1) FPGA_ID1
- (near HDR1) FPGA_ID0
- (NC on 256kx8)
- PLL VCC Decoupling
- Title
- Size:
- Date:
- File:
- A2
- Number:
- Time:
- Revision:
- Sheet
- of
- (in symbol EP1C20F400C8, part A) BANK 2; BANK 1
- (in symbol EP1C20F400C8, part B) BANK 4; BANK 3

### Library data of the parts
C1-C6 C50 C51 = CAP_POLAR: Polar Capacitor; Supplier: FARNELL
  C1-C6: Supplier Code: 967-117
  C50 C51: Supplier Code: 355-1829
C7-C49 C52-C71 = CAP: Capacitor
  C7-C17: Supplier: FARNELL; Supplier Code: 335-2020
  C18-C49: Supplier: FARNELL; Supplier Code: 772-236
  C52 C53: Supplier: FARNELL; Supplier Code: 499-687
  C54 C55: Supplier: FARNELL; Supplier Code: 383-4980
HDR1 = 54075-1009-HD1: Board-to-Board, Docking Station, 0.80mm (.031") Pitch, Shielded Receptacle, Vertical, Ultra Low Profile, SMT; Manufacturer: Molex; Package Information: Latest Revision: Jun-2001; Mating Height: 8.5mm; Voltage: 100V; Current: 0.5A; Contact Resistance: 40mOhm max; PCB Layout: Complies with Manufacturer's Recommendation.; Published: 15-Oct-2003; Datasheet: Latest Revision: Feb-2002; Package Reference: 54075; Publisher: Altium Limited
HDR2 = 54075-1009-HD2: Board-to-Board, Docking Station, 0.80mm (.031") Pitch, Shielded Receptacle, Vertical, Ultra Low Profile, SMT; Manufacturer: Molex; Package Information: Latest Revision: Jun-2001; Mating Height: 8.5mm; Voltage: 100V; Current: 0.5A; Contact Resistance: 40mOhm max; PCB Layout: Complies with Manufacturer's Recommendation.; Published: 15-Oct-2003; Datasheet: Latest Revision: Feb-2002; Package Reference: 54075; Publisher: Altium Limited
L1 = Inductor: Ferrite Bead; Value: 10mH; Published: 8-Jun-2000; Revision: July-2002: Re-released for DXP Platform.; Publisher: Altium Limited; Supplier: FARNELL; Supplier Code: 323-7989
LED1 LED2 = HSMX-C670: Typical RED GaAs SMD LED Agilent make; Manufacturer: Generic Components; Class I: Optoelectronic; Fitted: True; Published: 8-Jun-2000; Revision: July-2002: Re-released for DXP Platform.; Publisher: Altium Limited; Class II: LED
R1-R3 R5-R12 = RES: Resistor
TP1-TP14 = TestPin
U1 = EP1C20F400C8: Cyclone Family, 1.5V FPGA, 301 I/O Pins, 2 x PLLs, Commercial Grade, Speed Grade 8; PackageDocument: ver11.0, Feb-2003; Published: 17-Sep-2003; DatasheetDocument: ver1.4, Jan-2004; PackageReference: FBGA400; Publisher: Altium Limited; Code_JEDEC: MS-034-AAJ-1; Code_IPC: PBGA 21X21 FE400
U2 = SN74AHC1G04DBVR: Manufacturer: TI; Fitted: True
U3 U4 = SRAM 512Kx16 TSOP44: 512Kx16Bit SRAM TSOP44; Supplier: IDT; Supplier Code: 71V416L10PH